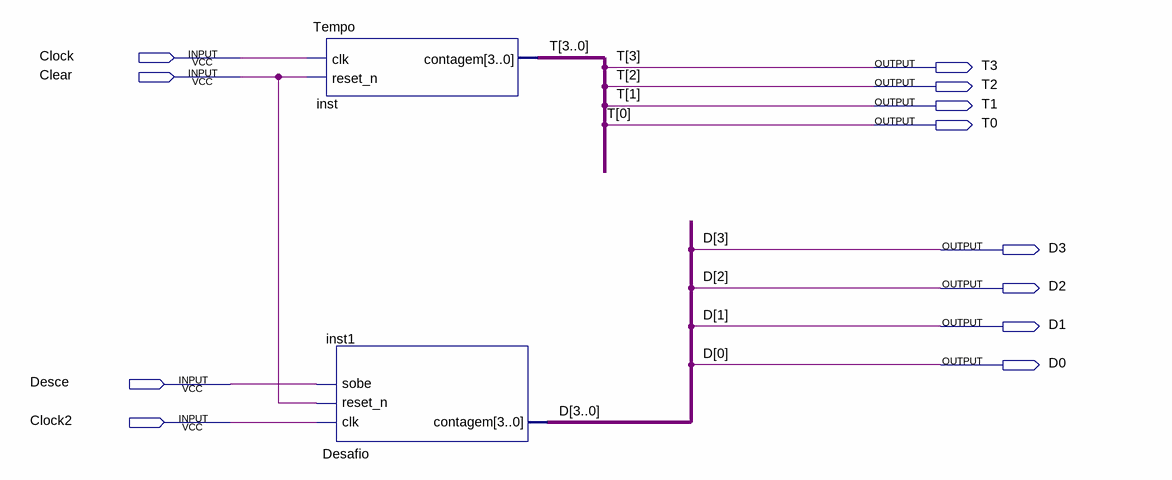
[diagram p0: schematic sheet]
// Quartus schematic Tempo_Desafio.bdf as structural Verilog: 2 symbols, 12 pins
module Tempo_Desafio (
  input  Clock,
  input  Clear,
  input  Desce,
  input  Clock2,
  output T3,
  output T2,
  output T1,
  output T0,
  output D3,
  output D2,
  output D1,
  output D0
);

  Tempo inst (.clk(Clock), .reset_n(Clear), .contagem({T3, T2, T1, T0}));
  Desafio inst1 (.clk(Clock2), .reset_n(Clear), .sobe(Desce), .contagem({D3, D2, D1, D0}));
endmodule
